# Altium schematic sheet OnlyRes.SchDoc
size A
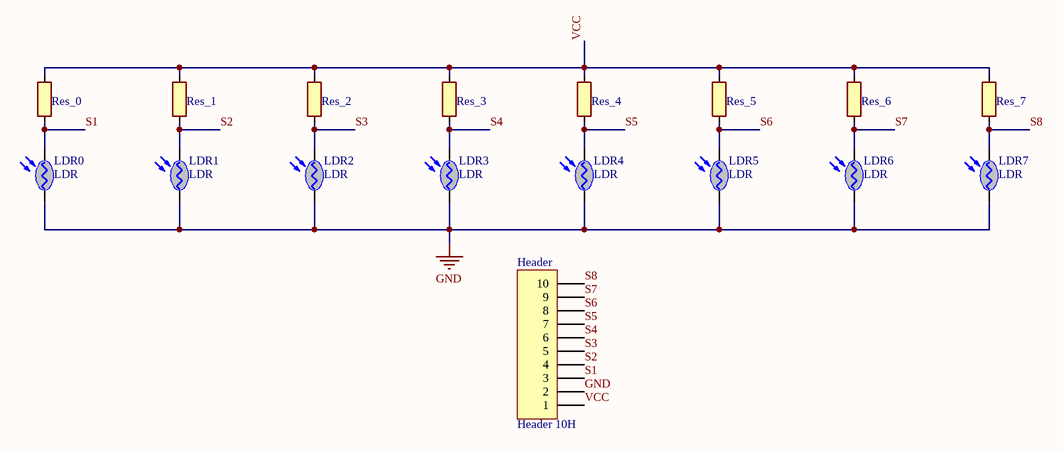
[diagram p0: OnlyRes.SchDoc]

## Parts
Header  Header 10H  [HDR1X10H]
LDR0  LDR  [CDS]
LDR1  LDR  [CDS]
LDR2  LDR  [CDS]
LDR3  LDR  [CDS]
LDR4  LDR  [CDS]
LDR5  LDR  [CDS]
LDR6  LDR  [CDS]
LDR7  LDR  [CDS]
Res_0  Res  [Resistor_300mil]  (value not drawn)
Res_1  Res  [Resistor_300mil]  (value not drawn)
Res_2  Res  [Resistor_300mil]  (value not drawn)
Res_3  Res  [Resistor_300mil]  (value not drawn)
Res_4  Res  [Resistor_300mil]  (value not drawn)
Res_5  Res  [Resistor_300mil]  (value not drawn)
Res_6  Res  [Resistor_300mil]  (value not drawn)
Res_7  Res  [Resistor_300mil]  (value not drawn)

## Nets
GND: Header.2 LDR0.1(A) LDR1.1(A) LDR2.1(A) LDR3.1(A) LDR4.1(A) LDR5.1(A) LDR6.1(A) LDR7.1(A)
S1: Header.3 LDR0.2(K) Res_0.1
S2: Header.4 LDR1.2(K) Res_1.2
S3: Header.5 LDR2.2(K) Res_2.1
S4: Header.6 LDR3.2(K) Res_3.1
S5: Header.7 LDR4.2(K) Res_4.1
S6: Header.8 LDR5.2(K) Res_5.1
S7: Header.9 LDR6.2(K) Res_6.2
S8: Header.10 LDR7.2(K) Res_7.1
VCC: Header.1 Res_0.2 Res_1.1 Res_2.2 Res_3.2 Res_4.2 Res_5.2 Res_6.1 Res_7.2

## Library data of the parts
Header = Header 10H: Header, 10-Pin, Right Angle; LatestRevisionDate: 17-Jul-2002; LatestRevisionNote: Re-released for DXP Platform.; Publisher: Altium Limited
LDR0-LDR7 = LDR: Quang Tro